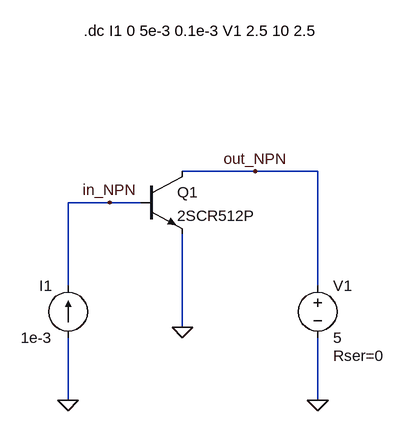
[diagram p0: schematic priklad1.asc]
priklad1.asc, the LTspice schematic file:
Version 4
SHEET 1 880 680
WIRE -112 -16 -224 -16
WIRE -16 -16 -112 -16
WIRE -336 32 -400 32
WIRE -288 32 -336 32
WIRE -400 160 -400 32
WIRE -16 160 -16 -16
WIRE -224 224 -224 80
WIRE -400 336 -400 240
WIRE -16 336 -16 240
FLAG -400 336 0
FLAG -224 224 0
FLAG -16 336 0
FLAG -336 32 in_NPN
FLAG -112 -16 out_NPN
SYMBOL voltage -16 144 R0
WINDOW 123 0 0 Left 2
WINDOW 39 24 124 Left 2
SYMATTR InstName V1
SYMATTR Value 5
SYMATTR SpiceLine Rser=0
SYMBOL current -400 240 R180
WINDOW 0 24 80 Left 2
WINDOW 3 24 0 Left 2
WINDOW 123 0 0 Left 2
WINDOW 39 0 0 Left 2
SYMATTR InstName I1
SYMATTR Value 1e-3
SYMBOL npn -288 -16 R0
SYMATTR InstName Q1
SYMATTR Value 2SCR512P
TEXT -376 -232 Left 2 !.dc I1 0 5e-3 0.1e-3 V1 2.5 10 2.5

The netlist it stands for:
* priklad1.asc
V1 out_NPN 0 5 Rser=0
I1 0 in_NPN 1e-3
Q1 out_NPN in_NPN 0 0 2SCR512P
.model NPN NPN
.model PNP PNP
.lib standard.bjt
.dc I1 0 5e-3 0.1e-3 V1 2.5 10 2.5
.backanno
.end